# Altium schematic sheet LM2596.SchDoc
size A4; SheetNumber: 2; SheetTotal: 4
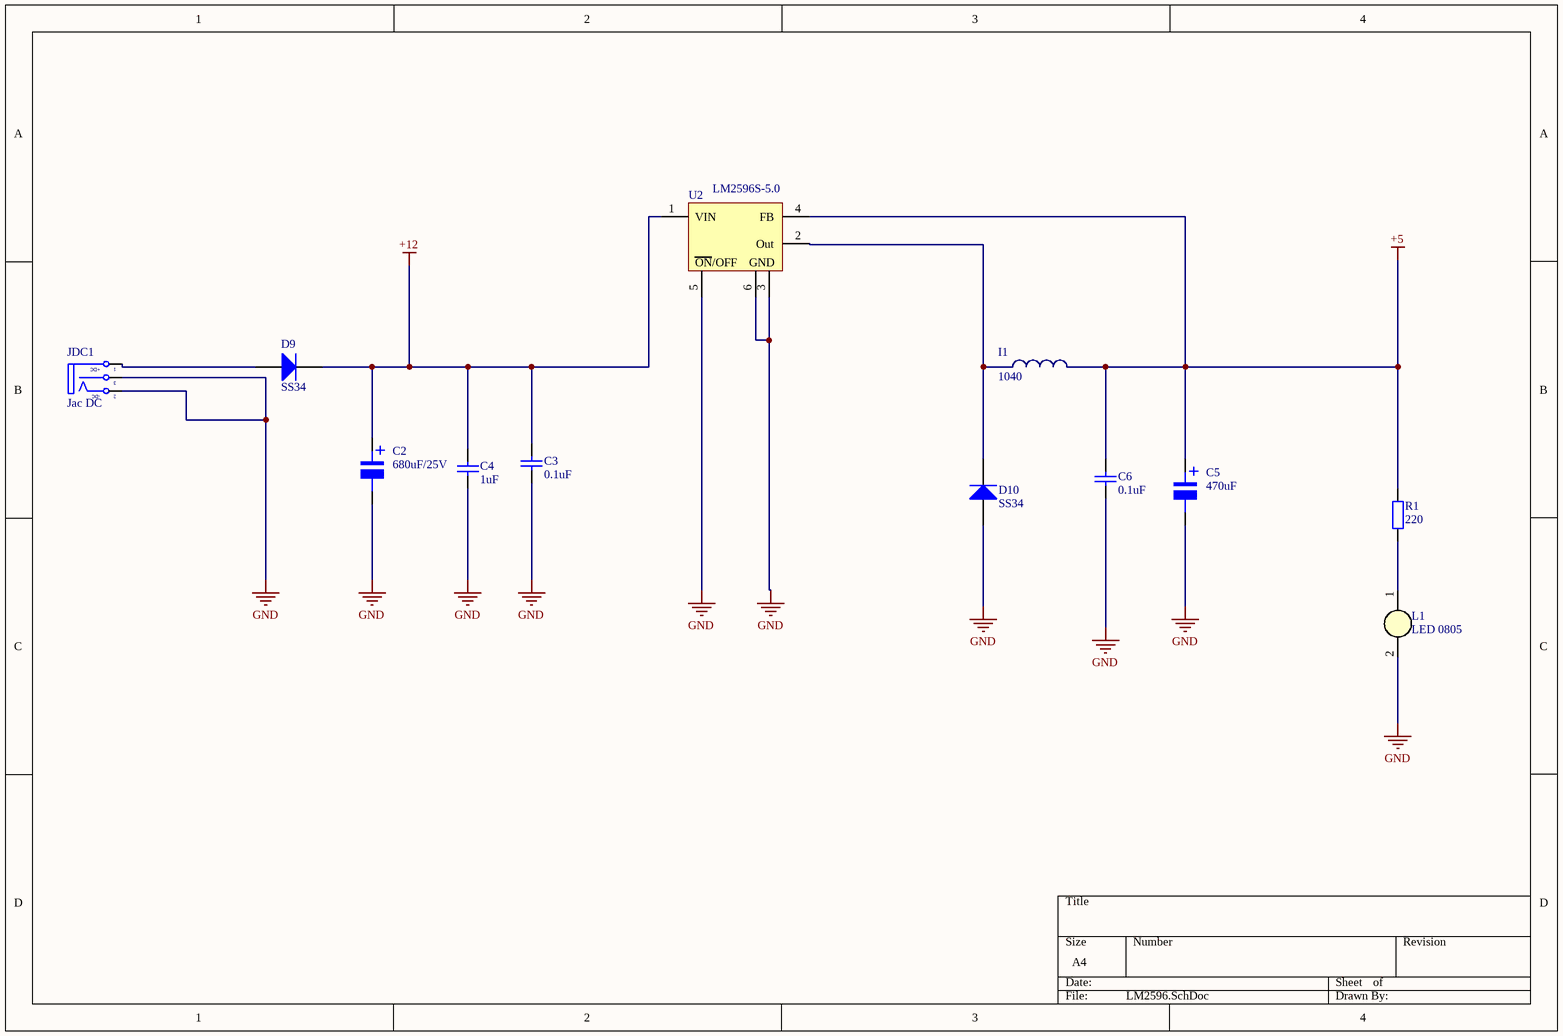
[diagram p0: LM2596.SchDoc]

## Parts
C2  680uF/25V  [tu nhom 10 (G)]
C3  0.1uF  [tu 0603]
C4  1uF  [tu 0603]
C5  470uF  [tu nhom 10 (G)]
C6  0.1uF  [tu 0603]
D9  SS34  [DIODE SMA]
D10  SS34  [DIODE SMA]
I1  1040  [1040]
JDC1  Jac DC  [DC0]
L1  LED 0805  [LED-0805-Yellow]
R1  220  [tro smd 0805]
U2  LM2596S-5.0  [TO-263-5]

## Nets
+5: C5.1 C6.1 I1.2 R1.2 U2.4(FB)
+12: C2.1 C3.1 C4.1 D9.2(K) U2.1(VIN)
GND: C2.2 C3.2 C4.2 C5.2 C6.2 D10.1(A) JDC1.2(TN) JDC1.3(S) L1.2(K) U2.3(GND) U2.5(~{ON}/OFF) U2.6(PAD)
NetD9_1: D9.1(A) JDC1.1(T)
NetD10_2: D10.2(K) I1.1 U2.2(Out)
NetL1_1: L1.1(A) R1.1

## Notes on the sheet
- (in symbol DCIN) +DC; -DC
- (in symbol LM2596S-5.0) ON/OFF
- (in symbol Tu Nhom 470uF 35V) +
- (in symbol Tu Nhom 680uF 16V) +

## Library data of the parts
C2 = Tu Nhom 680uF 16V: Dán; Don_Vi: Con; So_Chan: 2; Ten_Linh_Kien: Tụ Nhôm 680uF 16V 10x10.5MM; Ma_Hang: MH007513; Chung_Loai: Dán; Kieu_Chan: *
C3 C6 = Tu 0603 104 50V 10%: Dán; Don_Vi: Con; So_Chan: 2; Ten_Linh_Kien: Tụ 0603 104-100nF 10% 50V; Ma_Hang: MH004568; Chung_Loai: Dán; Kieu_Chan: *
C4 = Tu 0603 105 50V 10%: Dán; Don_Vi: Con; So_Chan: 2; Ten_Linh_Kien: Tụ 0603 105-1uF 50V 10%; Ma_Hang: MH004569; Chung_Loai: Dán; Kieu_Chan: *
C5 = Tu Nhom 470uF 35V: Dán; Don_Vi: Con; So_Chan: 2; Ten_Linh_Kien: Tụ Nhôm 470uF 35V 10x10.5MM; Ma_Hang: MH004418; Chung_Loai: Dán; Kieu_Chan: *
D9 D10 = Diode SS34 ( 1N5822 ): Dán; Don_Vi: Con; Ma_Hang: MH002104; Ten_Linh_Kien: Diode SS34 3A 40V SMA ( 1N5822 SS34A); Kieu_Chan: *; Chung_Loai: Dán
I1 = 1040: Generic Encapsulated Inductor 1040.
JDC1 = DCIN: Jac DC input; Value: Jac DC
L1 = LED 0805 Trang: Dán; Don_Vi: Con; Ma_Hang: MH002946; Ten_Linh_Kien: LED 0805 Màu Trắng ( White); Ghi_Chu: *; Kieu_Chan: *; Chung_Loai: Dán
R1 = Tro 0805 1% 1k: Dán; Don_Vi: Con; So_Chan: 2; Ten_Linh_Kien: Trở 0805 1% 1k; Ma_Hang: MH005468; Chung_Loai: Dán; Kieu_Chan: *
U2 = LM2596S-5.0: Simple Switcher 3A Step-Down Voltage Regulator